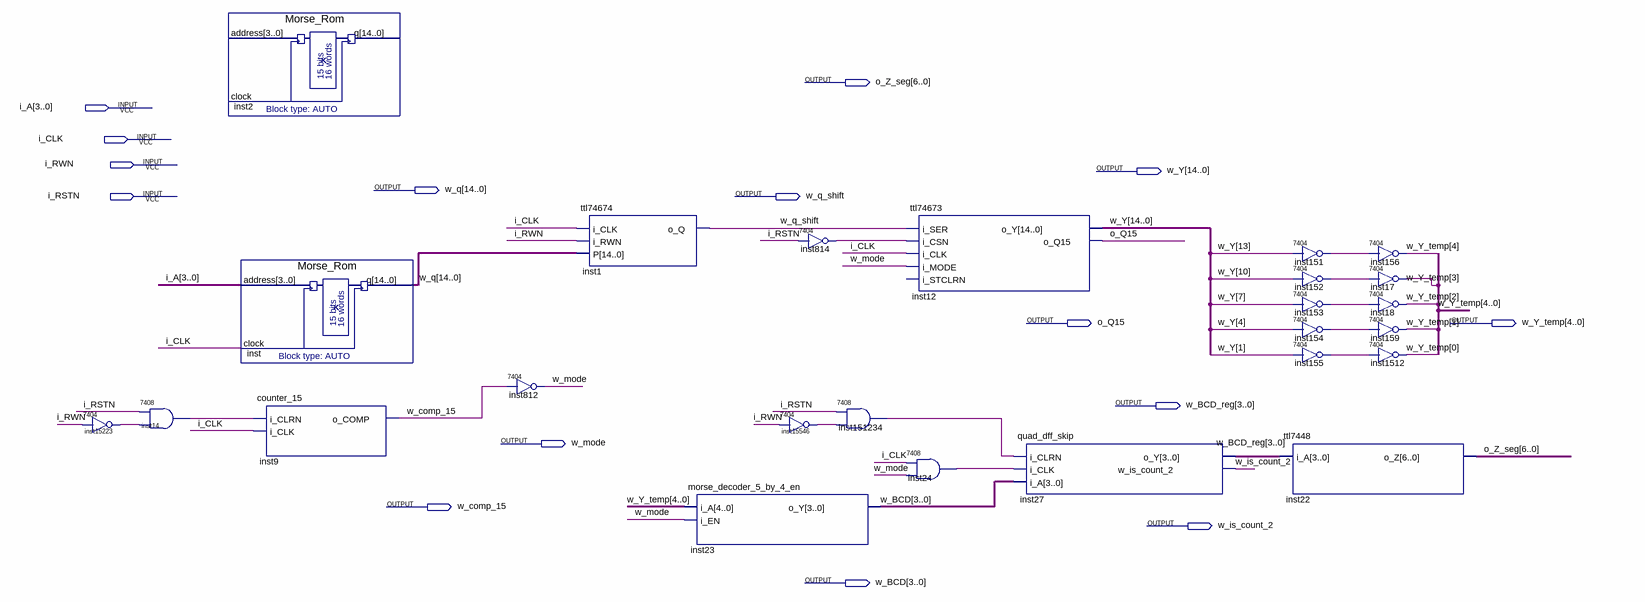
[diagram p0: schematic sheet]
// Quartus schematic top.bdf as structural Verilog: 25 symbols, 15 pins
module top (
  input  [3:0] i_A,
  input  i_CLK,
  input  i_RWN,
  input  i_RSTN,
  output [6:0] o_Z_seg,
  output [14:0] w_Y,
  output [14:0] w_q,
  output w_q_shift,
  output o_Q15,
  output [4:0] w_Y_temp,
  output [3:0] w_BCD_reg,
  output w_mode,
  output w_comp_15,
  output w_is_count_2,
  output [3:0] w_BCD
);

  wire inst14_1, inst24_1, inst151_1, inst152_1, inst153_1, inst154_1, inst155_1, inst814_1, inst15223_1,
       inst15546_1, inst151234_1;

  \7404  inst15223 (.\2 (i_RWN), .\1 (inst15223_1));
  \7408  inst14 (.\3 (inst15223_1), .\2 (i_RSTN), .\1 (inst14_1));
  Morse_Rom inst2 ();  // open: address, clock, q
  Morse_Rom inst (.address(i_A), .clock(i_CLK), .q(w_q));
  counter_15 inst9 (.i_CLRN(inst14_1), .i_CLK(i_CLK), .o_COMP(w_comp_15));
  \7404  inst812 (.\2 (w_comp_15), .\1 (w_mode));
  ttl74674 inst1 (.i_CLK(i_CLK), .i_RWN(i_RWN), .P(w_q), .o_Q(w_q_shift));
  morse_decoder_5_by_4_en inst23 (.i_A(w_Y_temp), .i_EN(w_mode), .o_Y(w_BCD));
  \7404  inst814 (.\2 (i_RSTN), .\1 (inst814_1));
  \7404  inst15546 (.\2 (i_RWN), .\1 (inst15546_1));
  \7408  inst151234 (.\3 (inst15546_1), .\2 (i_RSTN), .\1 (inst151234_1));
  ttl74673 inst12 (
    .i_SER(w_q_shift), .i_CSN(inst814_1), .i_CLK(i_CLK), .i_MODE(w_mode), .o_Y(w_Y), .o_Q15(o_Q15));  // open: i_STCLRN
  \7408  inst24 (.\3 (w_mode), .\2 (i_CLK), .\1 (inst24_1));
  quad_dff_skip inst27 (
    .i_CLRN(inst151234_1), .i_CLK(inst24_1), .i_A(w_BCD), .o_Y(w_BCD_reg), .w_is_count_2(w_is_count_2));
  \7404  inst151 (.\2 (w_Y[13]), .\1 (inst151_1));
  \7404  inst152 (.\2 (w_Y[10]), .\1 (inst152_1));
  \7404  inst153 (.\2 (w_Y[7]), .\1 (inst153_1));
  \7404  inst154 (.\2 (w_Y[4]), .\1 (inst154_1));
  \7404  inst155 (.\2 (w_Y[1]), .\1 (inst155_1));
  ttl7448 inst22 (.i_A(w_BCD_reg), .o_Z(o_Z_seg));
  \7404  inst156 (.\2 (inst151_1), .\1 (w_Y_temp[4]));
  \7404  inst17 (.\2 (inst152_1), .\1 (w_Y_temp[3]));
  \7404  inst18 (.\2 (inst153_1), .\1 (w_Y_temp[2]));
  \7404  inst159 (.\2 (inst154_1), .\1 (w_Y_temp[1]));
  \7404  inst1512 (.\2 (inst155_1), .\1 (w_Y_temp[0]));
endmodule
